# Altium project mix.PrjPCB
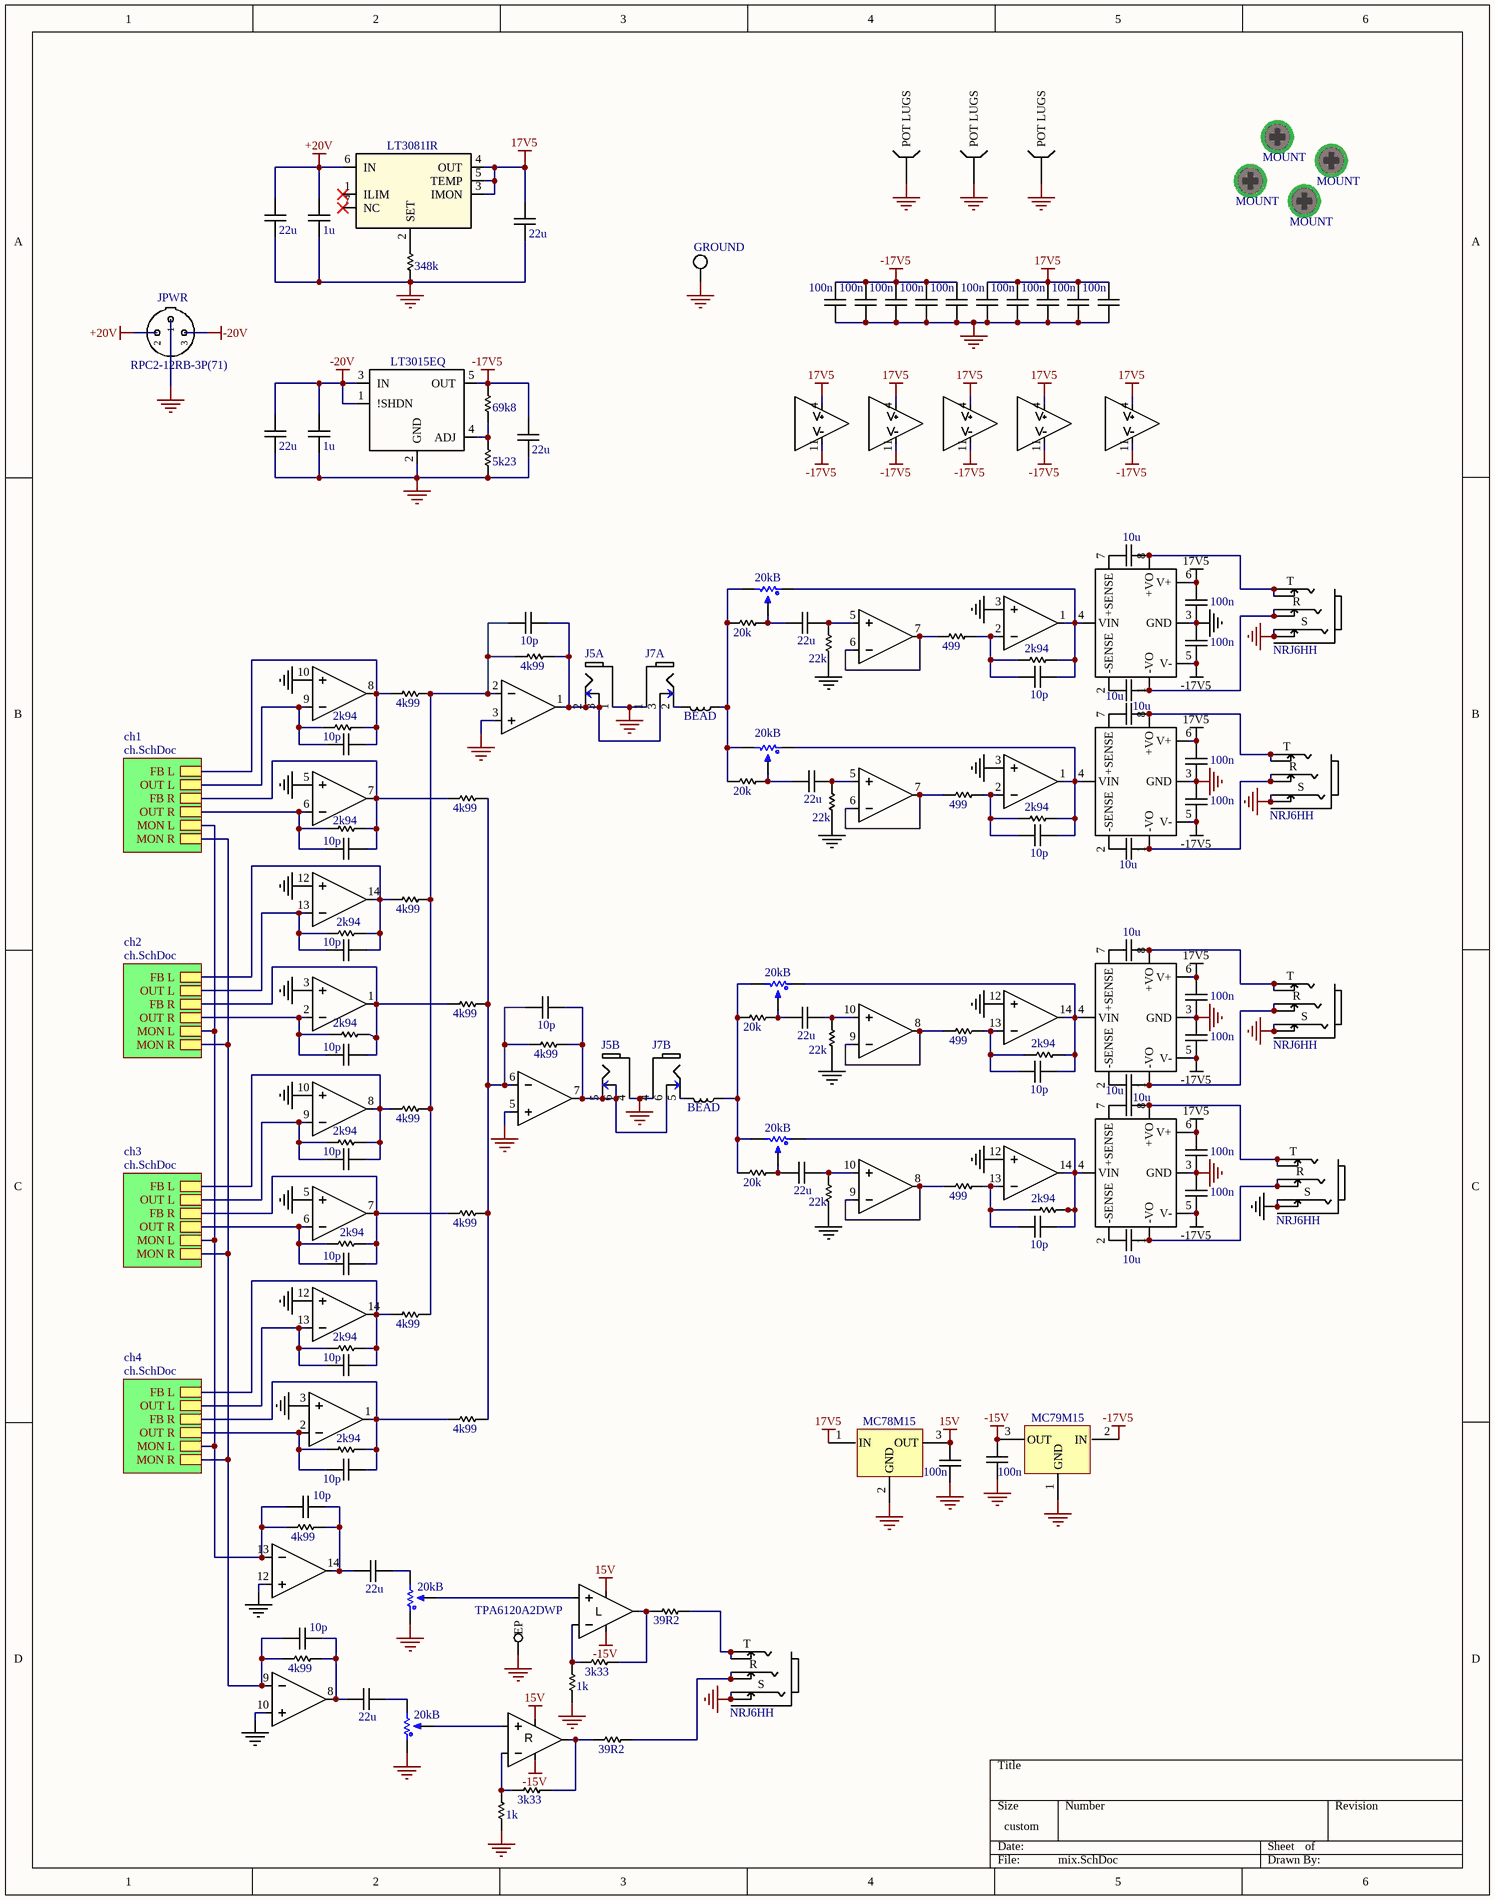
[diagram p0: mix.SchDoc]
3 sheets, 1145 parts. Net scope: hierarchical (ports join the sheet entries above them; power ports are global).
Board file: mix.pcbdoc
Sheets:
  mix.SchDoc
    ch1 = ch.SchDoc
      rxo = xover.SchDoc
      lxo = xover.SchDoc
    ch2 = ch.SchDoc
      rxo = xover.SchDoc
      lxo = xover.SchDoc
    ch3 = ch.SchDoc
      rxo = xover.SchDoc
      lxo = xover.SchDoc
    ch4 = ch.SchDoc
      rxo = xover.SchDoc
      lxo = xover.SchDoc

## Sheet mix.SchDoc
size 279 x 355 mm

### Parts
C5  100n  [0805]
C7  100n  [0805]
C15  100n  [0805]
C17  100n  [0805]
C23  10p  [0805]
C24  100n  [0805]
C26  100n  [0805]
C31  100n  [0805]
C33  100n  [0805]
C36  22u  [0805]
C37  10p  [0805]
C38  100n  [0805]
C39  22u  [0805]
C40  100n  [0805]
C41  10p  [0805]
C43  10p  [0805]
C45  10p  [0805]
C46  100n  [0805]
C47  10p  [0805]
C48  22u  [0805]
C49  100n  [0805]
C50  10p  [0805]
C52  22u  [0805]
C54  10p  [0805]
C55  22u  [0805]
C56  10p  [0805]
C57  22u  [0805]
C58  10p  [0805]
C59  10p  [0805]
C60  10p  [0805]
C61  10p  [0805]
C62  10p  [0805]
C63  10p  [0805]
C64  10p  [0805]
C983  22u  [0805]
C984  1u  [0805]
C985  22u  [0805]
C988  22u  [0805]
C989  1u  [0805]
C990  22u  [0805]
C1002  100n  [0805]
C1003  100n  [0805]
C1004  100n  [0805]
C1005  100n  [0805]
C1006  100n  [0805]
C1007  100n  [0805]
C1008  100n  [0805]
C1010  100n  [0805]
C2001  10u  [0805]
C2002  10u  [0805]
C2003  10u  [0805]
C2004  10u  [0805]
C2005  10u  [0805]
C2006  10u  [0805]
C2007  10u  [0805]
C2008  10u  [0805]
GROUND  PHONO  [PAD]  (value not drawn)  (no BOM)
J1  NRJ6HH  [NRJ6HH]
J2  NRJ6HH  [NRJ6HH]
J3  NRJ6HH  [NRJ6HH]
J4  NRJ6HH  [NRJ6HH]
J5  PJRAN2X1U01AUX  [PJRAN2X1U01AUX]  (value not drawn)  (parts A,B of 2)
J6  NRJ6HH  [NRJ6HH]
J7  PJRAN2X1U01AUX  [PJRAN2X1U01AUX]  (value not drawn)  (parts A,B of 2)
JPWR  RPC2-12RB-3P(71)  [RPC2-12RB-3P(71)]
L3  BEAD  [0805]
L4  BEAD  [0805]
MH1  MOUNT  [MOUNT]  (no BOM)
MH2  MOUNT  [MOUNT]  (no BOM)
MH3  MOUNT  [MOUNT]  (no BOM)
MH4  MOUNT  [MOUNT]  (no BOM)
R5  20kB  [P0925N-FC15AR10K]  (parts A,B,C of 3)
R6  20kB  [P0925N-FC15AR10K]  (parts A,B,C of 3)
R7  20kB  [P0925N-FC15AR10K]  (parts A,B,C of 3)
R13  4k99  [0805]
R26  3k33  [0805]
R27  3k33  [0805]
R29  1k  [0805]
R30  39R2  [0805]
R31  39R2  [0805]
R32  1k  [0805]
R47  499  [0805]
R49  22k  [0805]
R50  2k94  [0805]
R51  4k99  [0805]
R71  20k  [0805]
R75  20k  [0805]
R76  499  [0805]
R77  2k94  [0805]
R78  22k  [0805]
R79  2k94  [0805]
R80  4k99  [0805]
R81  2k94  [0805]
R82  4k99  [0805]
R83  2k94  [0805]
R84  499  [0805]
R85  4k99  [0805]
R86  22k  [0805]
R87  2k94  [0805]
R88  4k99  [0805]
R89  2k94  [0805]
R90  499  [0805]
R91  22k  [0805]
R92  4k99  [0805]
R93  2k94  [0805]
R94  2k94  [0805]
R95  4k99  [0805]
R96  2k94  [0805]
R97  4k99  [0805]
R98  2k94  [0805]
R99  4k99  [0805]
R100  2k94  [0805]
R101  348k  [0805]
R102  5k23  [0805]
R103  69k8  [0805]
R104  20k  [0805]
R105  20k  [0805]
R106  4k99  [0805]
R107  4k99  [0805]
U6  OPA16X4  [SOIC127P600X175-14M]  (value not drawn)  (parts A,B,C,D,E of 5)
U7  OPA16X4  [SOIC127P600X175-14M]  (value not drawn)  (parts A,B,C,D,E of 5)
U8  OPA16X4  [SOIC127P600X175-14M]  (value not drawn)  (parts A,B,C,D,E of 5)
U9  OPA16X4  [SOIC127P600X175-14M]  (value not drawn)  (parts A,B,C,D,E of 5)
U10  OPA16X4  [SOIC127P600X175-14M]  (value not drawn)  (parts A,B,C,D,E of 5)
U11  LT3081IR  [DDPAK-7]
U12  LT3015EQ  [DDPAK-5_Q]
U13  DRV135  [SOIC127P600X175-8M]  (value not drawn)
U14  DRV135  [SOIC127P600X175-8M]  (value not drawn)
U15  DRV135  [SOIC127P600X175-8M]  (value not drawn)
U16  DRV135  [SOIC127P600X175-8M]  (value not drawn)
U17  TPA6120A2DWP  [SOIC127P1040X265_HS-21M]  (parts A,B,C of 3)
U18  MC78M15  [DPAK-3]
U19  MC79M15  [DPAK-3]

### Sub-sheets
ch1 = ch.SchDoc: OUT L, OUT R, MON L, MON R, FB L, FB R
ch2 = ch.SchDoc: OUT L, OUT R, MON L, MON R, FB L, FB R
ch3 = ch.SchDoc: OUT L, OUT R, MON L, MON R, FB L, FB R
ch4 = ch.SchDoc: OUT L, OUT R, MON L, MON R, FB L, FB R

### Nets
15V: C1002.1 U17.3(LV+) U17.18(RV+) U18.3(OUT)
17V5: C15.1 C17.1 C24.1 C31.1 C38.1 C46.1 C985.2 C1005.1 C1007.1 C1010.1 U6.4(V+) U7.4(V+) U8.4(V+) U9.4(V+) U10.4(V+) U11.3(IMON) U11.4(OUT) U11.5(TEMP) U13.6(V+) U14.6(V+) U15.6(V+) U16.6(V+) U18.1(IN)
+20V: C983.2 C984.2 JPWR.2 U11.6(IN)
-15V: C1003.1 U17.1(LV-) U17.20(RV-) U19.3(OUT)
-17V5: C5.1 C7.1 C26.2 C33.2 C40.2 C49.2 C990.2 C1004.1 C1006.1 C1008.1 R103.2 U6.11(V-) U7.11(V-) U8.11(V-) U9.11(V-) U10.11(V-) U12.5(OUT) U13.5(V-) U14.5(V-) U15.5(V-) U16.5(V-) U19.2(IN)
-20V: C988.2 C989.2 JPWR.3 U12.1(!SHDN) U12.3(IN)
GND: C5.2 C7.2 C15.2 C17.2 C24.2 C26.1 C31.2 C33.1 C38.2 C40.1 C46.2 C49.1 C983.1 C984.1 C985.1 C988.1 C989.1 C990.1 C1002.2 C1003.2 C1004.2 C1005.2 C1006.2 C1007.2 C1008.2 C1010.2 GROUND.1 J1.S J1.SN J2.S J2.SN J3.S J3.SN J4.S J4.SN J5.1 J5.4 J6.S J6.SN J7.1 J7.4 JPWR.1 R5.7(POT_LUGS) R6.7(POT_LUGS) R7.1 R7.4 R7.7(POT_LUGS) R29.1 R32.1 R49.1 R78.1 R86.1 R91.1 R101.1 R102.1 U6.3(+IN_A) U6.5(IN_B+) U6.10(IN_C+) U6.12(IN_D+) U7.3(+IN_A) U7.5(IN_B+) U7.10(IN_C+) U7.12(IN_D+) U8.3(+IN_A) U8.12(IN_D+) U9.3(+IN_A) U9.12(IN_D+) U10.3(+IN_A) U10.5(IN_B+) U10.10(IN_C+) U10.12(IN_D+) U12.2(GND) U13.3(GND) U14.3(GND) U15.3(GND) U16.3(GND) U17.21(EP) U18.2(GND) U19.1(GND)
NetC23_1: C23.1 R13.1 R51.2 R82.2 R92.2 R97.2 U10.2(-IN_A)
NetC23_2: C23.2 J5.2 J5.3 J7.3 R13.2 U10.1(OUT_A)
NetC36_1: C36.1 R5.2 R71.1
NetC36_2: C36.2 R49.2 U9.5(IN_B+)
NetC37_1: C37.1 R47.2 R50.1 U9.2(-IN_A)
NetC37_2: C37.2 R5.1 R50.2 U9.1(OUT_A) U13.4(VIN)
NetC39_1: C39.1 R6.2 R75.1
NetC39_2: C39.2 R78.2 U8.5(IN_B+)
NetC41_1: C41.1 R77.1 U6.9(IN_C-) ; sheet ch1/OUT L
NetC41_2: C41.2 R51.1 R77.2 U6.8(OUT_C) ; sheet ch1/FB L
NetC43_1: C43.1 R76.2 R79.1 U8.2(-IN_A)
NetC43_2: C43.2 R6.1 R79.2 U8.1(OUT_A) U14.4(VIN)
NetC45_1: C45.1 R81.1 U6.6(IN_B-) ; sheet ch1/OUT R
NetC45_2: C45.2 R80.1 R81.2 U6.7(OUT_B) ; sheet ch1/FB R
NetC47_1: C47.1 R80.2 R85.1 R88.2 R95.2 R99.2 U10.6(IN_B-)
NetC47_2: C47.2 J5.5 J5.6 J7.6 R85.2 U10.7(OUT_B)
NetC48_1: C48.1 R5.5 R104.1
NetC48_2: C48.2 R86.2 U9.10(IN_C+)
NetC50_1: C50.1 R83.1 U6.13(IN_D-) ; sheet ch2/OUT L
NetC50_2: C50.2 R82.1 R83.2 U6.14(OUT_D) ; sheet ch2/FB L
NetC52_1: C52.1 C63.2 R106.2 U10.14(OUT_D)
NetC52_2: C52.2 R7.3
NetC54_1: C54.1 R84.2 R87.1 U9.13(IN_D-)
NetC54_2: C54.2 R5.4 R87.2 U9.14(OUT_D) U15.4(VIN)
NetC55_1: C55.1 C64.2 R107.2 U10.8(OUT_C)
NetC55_2: C55.2 R7.6
NetC56_1: C56.1 R89.1 U6.2(-IN_A) ; sheet ch2/OUT R
NetC56_2: C56.2 R88.1 R89.2 U6.1(OUT_A) ; sheet ch2/FB R
NetC57_1: C57.1 R6.5 R105.1
NetC57_2: C57.2 R91.2 U8.10(IN_C+)
NetC58_1: C58.1 R90.2 R93.1 U8.13(IN_D-)
NetC58_2: C58.2 R6.4 R93.2 U8.14(OUT_D) U16.4(VIN)
NetC59_1: C59.1 R94.1 U7.9(IN_C-) ; sheet ch3/OUT L
NetC59_2: C59.2 R92.1 R94.2 U7.8(OUT_C) ; sheet ch3/FB L
NetC60_1: C60.1 R96.1 U7.6(IN_B-) ; sheet ch3/OUT R
NetC60_2: C60.2 R95.1 R96.2 U7.7(OUT_B) ; sheet ch3/FB R
NetC61_1: C61.1 R98.1 U7.13(IN_D-) ; sheet ch4/OUT L
NetC61_2: C61.2 R97.1 R98.2 U7.14(OUT_D) ; sheet ch4/FB L
NetC62_1: C62.1 R100.1 U7.2(-IN_A) ; sheet ch4/OUT R
NetC62_2: C62.2 R99.1 R100.2 U7.1(OUT_A) ; sheet ch4/FB R
NetC63_1: C63.1 R106.1 U10.13(IN_D-) ; sheet ch1/MON L, sheet ch2/MON L, sheet ch3/MON L, sheet ch4/MON L
NetC64_1: C64.1 R107.1 U10.9(IN_C-) ; sheet ch1/MON R, sheet ch2/MON R, sheet ch3/MON R, sheet ch4/MON R
NetC2001_1: C2001.1 U13.7(+SENSE)
NetC2001_2: C2001.2 J1.T J1.TN U13.8(+VO)
NetC2002_1: C2002.1 U13.2(-SENSE)
NetC2002_2: C2002.2 J1.R J1.RN U13.1(-VO)
NetC2003_1: C2003.1 U14.7(+SENSE)
NetC2003_2: C2003.2 J2.T J2.TN U14.8(+VO)
NetC2004_1: C2004.1 U14.2(-SENSE)
NetC2004_2: C2004.2 J2.R J2.RN U14.1(-VO)
NetC2005_1: C2005.1 U15.7(+SENSE)
NetC2005_2: C2005.2 J3.T J3.TN U15.8(+VO)
NetC2006_1: C2006.1 U15.2(-SENSE)
NetC2006_2: C2006.2 J3.R J3.RN U15.1(-VO)
NetC2007_1: C2007.1 U16.7(+SENSE)
NetC2007_2: C2007.2 J4.T J4.TN U16.8(+VO)
NetC2008_1: C2008.1 U16.2(-SENSE)
NetC2008_2: C2008.2 J4.R J4.RN U16.1(-VO)
NetJ6_R: J6.R J6.RN R31.2
NetJ6_T: J6.T J6.TN R30.2
NetJ7_2: J7.2 L3.2
NetJ7_5: J7.5 L4.2
NetL3_1: L3.1 R5.3 R6.3 R71.2 R75.2
NetL4_1: L4.1 R5.6 R6.6 R104.2 R105.2
NetR7_2: R7.2 U17.4(LIN+)
NetR7_5: R7.5 U17.17(RIN+)
NetR26_1: R26.1 R32.2 U17.16(RIN-)
NetR26_2: R26.2 R31.1 U17.19(ROUT)
NetR27_1: R27.1 R29.2 U17.5(LIN-)
NetR27_2: R27.2 R30.1 U17.2(LOUT)
NetR47_1: R47.1 U9.6(IN_B-) U9.7(OUT_B)
NetR76_1: R76.1 U8.6(IN_B-) U8.7(OUT_B)
NetR84_1: R84.1 U9.8(OUT_C) U9.9(IN_C-)
NetR90_1: R90.1 U8.8(OUT_C) U8.9(IN_C-)
NetR101_2: R101.2 U11.2(SET)
NetR102_2: R102.2 R103.1 U12.4(ADJ)

Not connected (* = marked no-connect by the designer): U11 1(ILIM)* 7(NC)*

### Notes on the sheet
- (in symbol TPA6120A2DWP, part A) L
- (in symbol TPA6120A2DWP, part B) R

### Library data of the parts
C5 C7 C15 C17 C24 C26 C31 C33 C38 C40 C46 C49 C1002-C1008 C1010 = CAP: PartNumber: C0805C104K1RAC7800; Supplier 1: Arrow; Supplier Part Number 1: C0805C104K1RAC7800
C23 C37 C41 C43 C45 C47 C50 C54 C56 C58-C64 = CAP: PartNumber: CC0805JRNPO9BN100; Supplier 1: Arrow; Supplier Part Number 1: CC0805JRNPO9BN100
C36 C39 C48 C52 C55 C57 C983 C985 C988 C990 = CAP: PartNumber: GRT21BR61E226ME13L; Supplier 1: Arrow; Supplier Part Number 1: GRT21BR61E226ME13L
  C983 C985 C988 C990: Value: 22u
C984 C989 = CAP: PartNumber: CL21B105KBFNNNF; Value: 1u; Supplier 1: Arrow; Supplier Part Number 1: CL21B105KBFNNNF
C2001-C2008 = CAP: PartNumber: NMC0805X5R106K25TRPLP2KF; Supplier 1: Arrow; Supplier Part Number 1: NMC0805X5R106K25TRPLP2KF
GROUND = PAD: Supplier 1: Arrow
J1-J4 J6 = NRJ6HH: PartNumber: NRJ6HH-AU; Supplier 1: Arrow; Supplier Part Number 1: NRJ6HH-AU
L3 L4 = BLM21PG121SH1D: Supplier 1: Arrow; Supplier Part Number 1: BLM21PG121SH1D; PartNumber: BLM21PG121SH1D
R5-R7 = P0925N-FC15BR20K: Supplier 1: Arrow; Supplier Part Number 1: P0925N-FC15BR20K; PartNumber: P0925N-FC15BR20K
R13 R51 R80 R82 R85 R88 R92 R95 R97 R99 R106 R107 = RES: PartNumber: ERJ-6ENF4991V; Supplier 1: Arrow; Supplier Part Number 1: ERJ-6ENF4991V
R26 R27 = RES: PartNumber: ERJ-6ENF1002V; Supplier 1: Arrow; Supplier Part Number 1: ERJ-6ENF1002V
R29 R32 = RES: PartNumber: ERJ-6ENF1001V; Supplier 1: Arrow; Supplier Part Number 1: ERJ-6ENF1001V
R30 R31 = RES: PartNumber: ERJ-6ENF39R2V; Supplier 1: Arrow; Supplier Part Number 1: ERJ-6ENF39R2V
R47 R76 R84 R90 = RES: PartNumber: ERJ-6ENF4990V; Supplier 1: Arrow; Supplier Part Number 1: ERJ-6ENF4990V
R49 R78 R86 R91 = RES: PartNumber: ERJ-6ENF2202V; Supplier 1: Arrow; Supplier Part Number 1: ERJ-6ENF2202V
R50 R77 R79 R81 R83 R87 R89 R93 R94 R96 R98 R100 = RES: PartNumber: ERJ-6ENF2941V; Supplier 1: Arrow; Supplier Part Number 1: ERJ-6ENF2941V
R71 R75 R104 R105 = RES: PartNumber: ERJ-6ENF2002V; Supplier 1: Arrow; Supplier Part Number 1: ERJ-6ENF2002V
R101 = RES: PartNumber: ERJ-PB6B3483V; Supplier 1: Arrow; Supplier Part Number 1: ERJ-PB6B3483V
R102 = RES: PartNumber: ERJ-PB6B5231V; Supplier 1: Arrow; Supplier Part Number 1: ERJ-PB6B5231V
R103 = RES: PartNumber: ERJ-PB6B6982V; Supplier 1: Arrow; Supplier Part Number 1: ERJ-PB6B6982V
U6-U10 = OPA16X4: PartNumber: OPA1664AIDR; Supplier 1: Arrow; Supplier Part Number 1: OPA1664AIDR
U11 = LT3081IR: Imported; PartNumber: LT3081IR#PBF; Supplier 1: Arrow; Supplier Part Number 1: LT3081IR#PBF
U12 = LT3015EQ: PartNumber: LT3015EQ#PBF; Supplier 1: Arrow; Supplier Part Number 1: LT3015EQ#PBF
U13-U16 = DRV135UA: PartNumber: DRV135UAG4; Supplier 1: Arrow; Supplier Part Number 1: DRV135UAG4
U17 = TPA6120A2DWP: PartNumber: TPA6120A2DWPR; Supplier 1: Arrow; Supplier Part Number 1: TPA6120A2DWPR
U18 = MC78M15CDTRKG: Supplier 1: Arrow; Supplier Part Number 1: MC78M15CDTRKG; PartNumber: MC78M15CDTRKG
U19 = MC79M15CDTRKG: Supplier 1: Arrow; Supplier Part Number 1: MC79M15CDTRKG; PartNumber: MC79M15CDTRKG
J5 J7 = PJRAN2X1U01AUX: Supplier 1: Arrow; Supplier Part Number 1: PJRAN2X1U01AUX; PartNumber: PJRAN2X1U01AUX
JPWR = RPC2-12RB-3P(71): Supplier 1: Arrow
MH1-MH4 = MOUNT: Supplier 1: Arrow

## Sheet ch.SchDoc
size 406 x 241 mm
Used 4 times, as channels ch1, ch2, ch3, ch4. Parts and nets are listed once, with the designators drawn on the sheet.
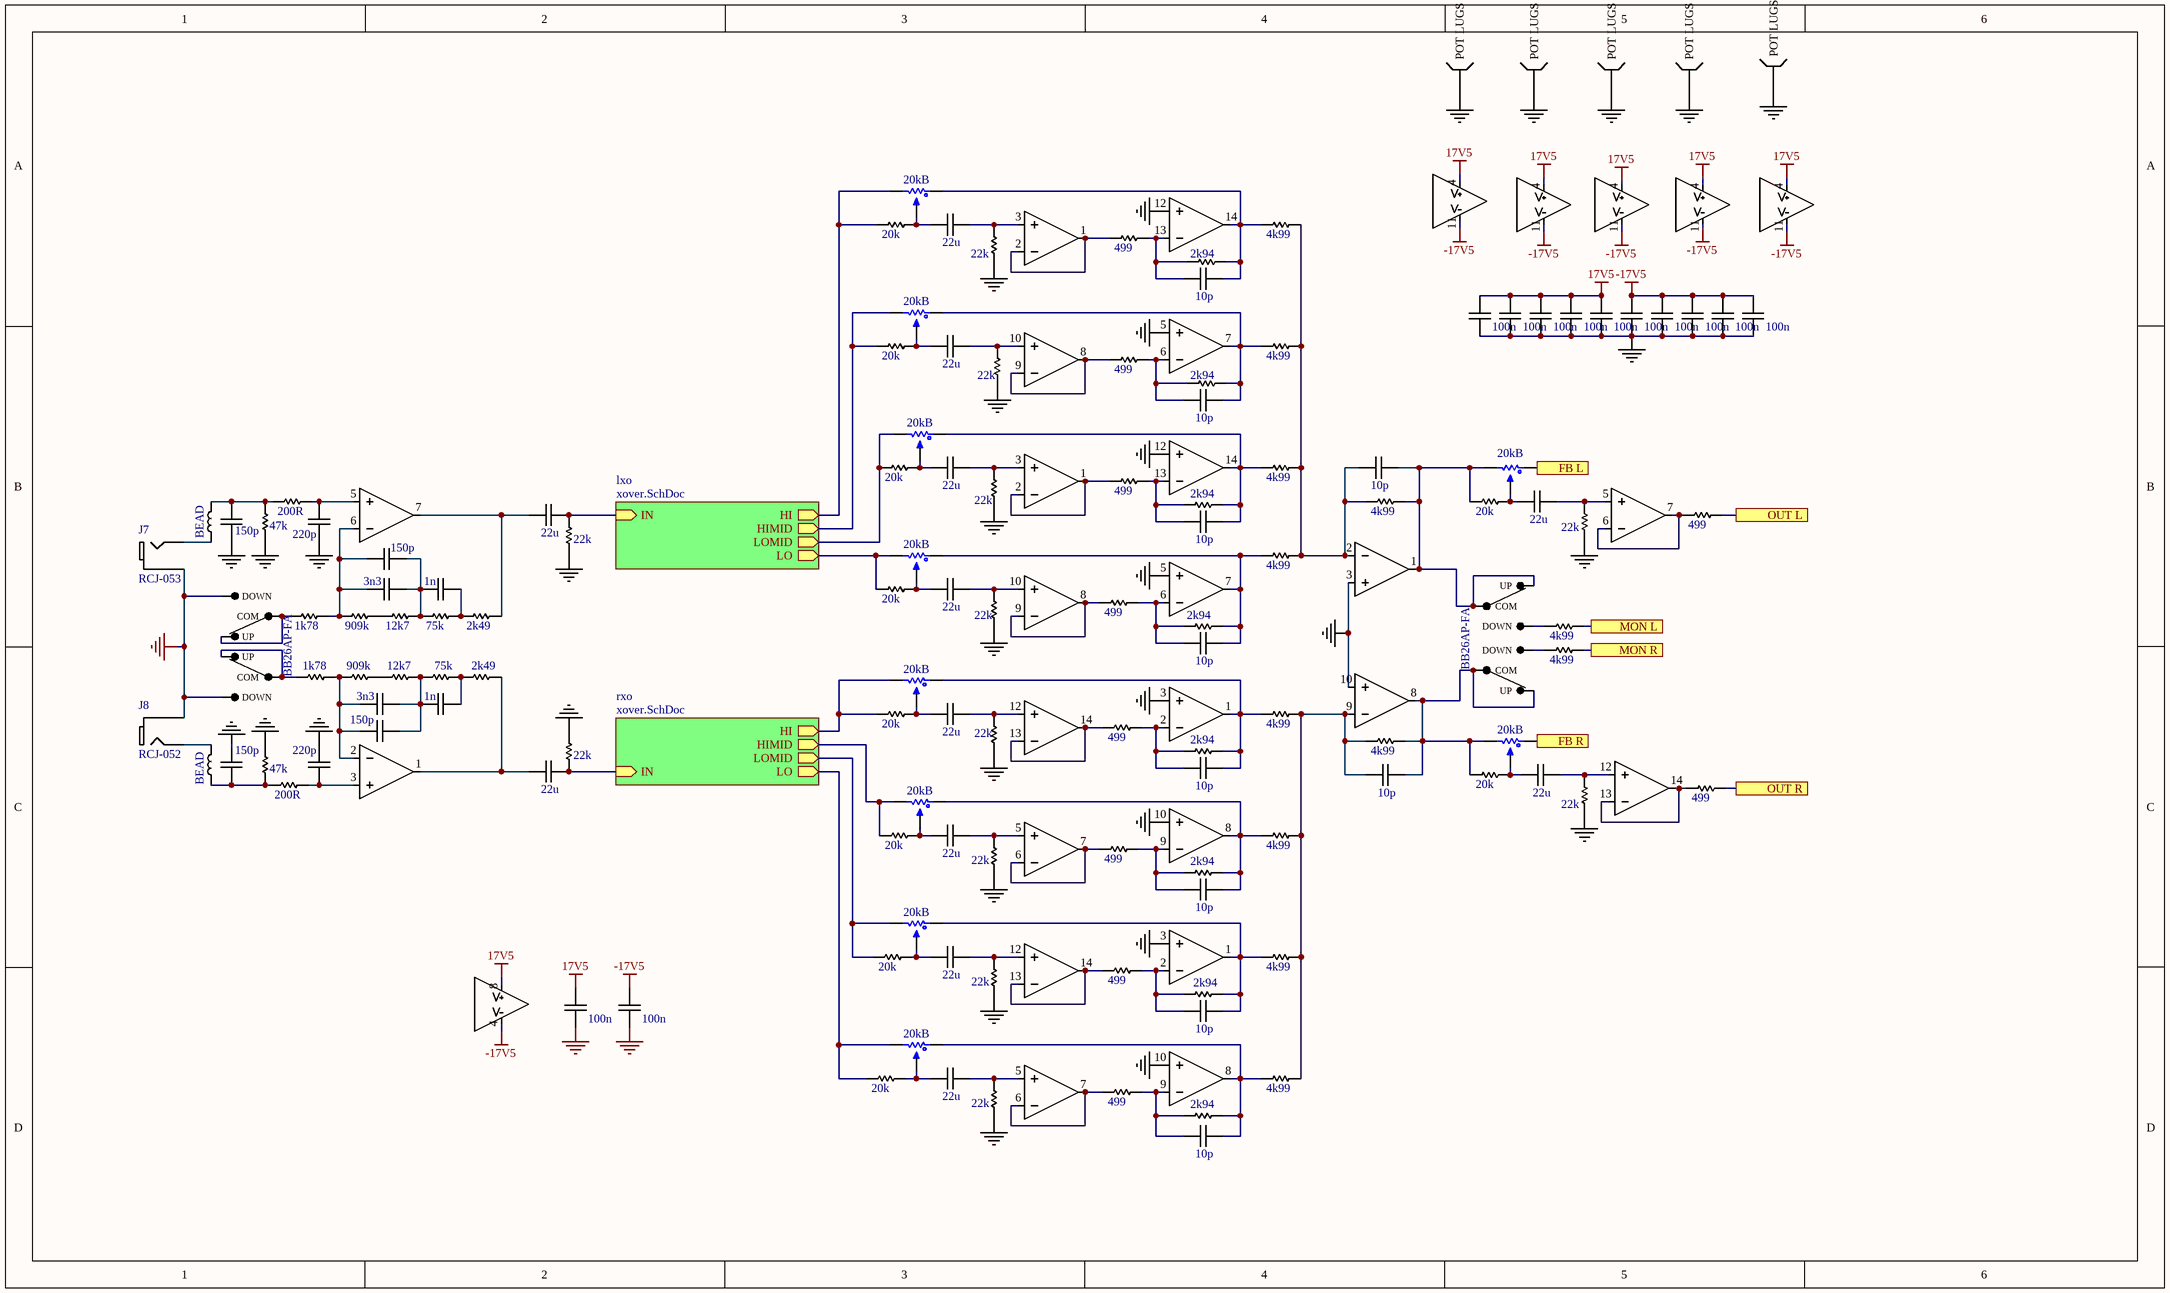
[diagram p1: ch.SchDoc]

### Parts
C1  22u  [0805]
C2  10p  [0805]
C3  100n  [0805]
C4  100n  [0805]
C6  100n  [0805]
C8  100n  [0805]
C9  100n  [0805]
C10  22u  [0805]
C11  10p  [0805]
C12  100n  [0805]
C13  22u  [0805]
C14  22u  [0805]
C16  10p  [0805]
C18  22u  [0805]
C19  10p  [0805]
C20  22u  [0805]
C21  10p  [0805]
C22  22u  [0805]
C25  22u  [0805]
C27  10p  [0805]
C28  10p  [0805]
C29  22u  [0805]
C32  10p  [0805]
C34  22u  [0805]
C35  10p  [0805]
C42  10p  [0805]
C63  220p  [0805]
C64  150p  [0805]
C65  22u  [0805]
C67  150p  [0805]
C68  3n3  [0805]
C69  1n  [0805]
C71  100n  [0805]
C72  100n  [0805]
C74  3n3  [0805]
C75  1n  [0805]
C76  150p  [0805]
C78  150p  [0805]
C79  22u  [0805]
C80  220p  [0805]
C203  100n  [0805]
C208  100n  [0805]
C210  100n  [0805]
C215  100n  [0805]
J7  RCJ-053  [RCJ-053]
J8  RCJ-052  [RCJ-052]
L1  BEAD  [0805]
L2  BEAD  [0805]
R1  20kB  [P0925N-FC15AR10K]  (parts A,B,C of 3)
R2  499  [0805]
R3  22k  [0805]
R4  2k94  [0805]
R8  499  [0805]
R9  22k  [0805]
R10  2k94  [0805]
R11  499  [0805]
R12  22k  [0805]
R14  4k99  [0805]
R15  499  [0805]
R16  20k  [0805]
R17  2k94  [0805]
R18  20k  [0805]
R19  22k  [0805]
R20  4k99  [0805]
R21  4k99  [0805]
R22  499  [0805]
R23  22k  [0805]
R24  2k94  [0805]
R25  20k  [0805]
R28  499  [0805]
R33  22k  [0805]
R34  2k94  [0805]
R35  20k  [0805]
R36  499  [0805]
R37  22k  [0805]
R38  499  [0805]
R39  22k  [0805]
R40  2k94  [0805]
R41  499  [0805]
R42  22k  [0805]
R43  2k94  [0805]
R44  499  [0805]
R45  22k  [0805]
R46  2k94  [0805]
R52  20k  [0805]
R53  200R  [0805]
R54  22k  [0805]
R55  47k  [0805]
R56  20k  [0805]
R57  909k  [0805]
R58  12k7  [0805]
R59  2k49  [0805]
R60  20k  [0805]
R61  20k  [0805]
R62  1k78  [0805]
R63  75k  [0805]
R64  20k  [0805]
R65  20k  [0805]
R66  909k  [0805]
R67  12k7  [0805]
R68  1k78  [0805]
R69  75k  [0805]
R70  2k49  [0805]
R72  47k  [0805]
R73  22k  [0805]
R74  200R  [0805]
R75  4k99  [0805]
R76  4k99  [0805]
R148  20kB  [P0925N-FC15AR10K]  (parts A,B,C of 3)
R149  20kB  [P0925N-FC15AR10K]  (parts A,B,C of 3)
R150  20kB  [P0925N-FC15AR10K]  (parts A,B,C of 3)
R151  20kB  [P0925N-FC15AR10K]  (parts A,B,C of 3)
R173  4k99  [0805]
R177  4k99  [0805]
R184  4k99  [0805]
R187  4k99  [0805]
R200  4k99  [0805]
R201  4k99  [0805]
R207  4k99  [0805]
SW1  BB26AP-FA  [BB26AP-FA]  (parts A,B of 2)
SW5  BB26AP-FA  [BB26AP-FA]  (value not drawn)  (parts A,B of 2)
U1  OPA16X4  [SOIC127P600X175-14M]  (value not drawn)  (parts A,B,C,D,E of 5)
U2  OPA16X4  [SOIC127P600X175-14M]  (value not drawn)  (parts A,B,C,D,E of 5)
U3  OPA16X4  [SOIC127P600X175-14M]  (value not drawn)  (parts A,B,C,D,E of 5)
U4  OPA16X4  [SOIC127P600X175-14M]  (value not drawn)  (parts A,B,C,D,E of 5)
U5  OPA16X4  [SOIC127P600X175-14M]  (value not drawn)  (parts A,B,C,D,E of 5)
U20  OPA16X2  [SOIC127P600X175-8M]  (value not drawn)  (parts A,B,C of 3)

### Sub-sheets
lxo = xover.SchDoc: IN (in), HI (out), HIMID (out), LOMID (out), LO (out)
rxo = xover.SchDoc: IN (in), HI (out), HIMID (out), LOMID (out), LO (out)

### Ports
FB L, FB R, MON L, MON R, OUT L, OUT R

### Nets
17V5: C3.1 C4.1 C9.1 C71.1 C203.1 C208.1 U1.4(V+) U2.4(V+) U3.4(V+) U4.4(V+) U5.4(V+) U20.8(V+)
-17V5: C6.1 C8.1 C12.1 C72.1 C210.1 C215.1 U1.11(V-) U2.11(V-) U3.11(V-) U4.11(V-) U5.11(V-) U20.4(V-)
GND: C3.2 C4.2 C6.2 C8.2 C9.2 C12.2 C63.1 C64.1 C71.2 C72.2 C78.2 C80.2 C203.2 C208.2 C210.2 C215.2 J7.1 J8.1 R1.7(POT_LUGS) R3.1 R9.1 R12.1 R19.1 R23.1 R33.1 R37.1 R39.1 R42.1 R45.1 R54.2 R55.1 R72.2 R73.1 R148.7(POT_LUGS) R149.7(POT_LUGS) R150.7(POT_LUGS) R151.7(POT_LUGS) SW5.1(DOWN) SW5.4(DOWN) U1.5(IN_B+) U1.12(IN_D+) U2.5(IN_B+) U2.12(IN_D+) U3.3(+IN_A) U3.10(IN_C+) U4.3(+IN_A) U4.10(IN_C+) U5.3(+IN_A) U5.10(IN_C+)
FB L: R1.1 ; port FB L
FB R: R1.4 ; port FB R
MON L: R75.2 ; port MON L
MON R: R76.2 ; port MON R
OUT L: R15.2 ; port OUT L
OUT R: R36.2 ; port OUT R
NetC1_1: C1.1 R16.1 R148.2
NetC1_2: C1.2 R3.2 U1.3(+IN_A)
NetC2_1: C2.1 R2.2 R4.1 U1.13(IN_D-)
NetC2_2: C2.2 R4.2 R148.1 R173.1 U1.14(OUT_D)
NetC10_1: C10.1 R18.1 R149.2
NetC10_2: C10.2 R9.2 U1.10(IN_C+)
NetC11_1: C11.1 R8.2 R10.1 U1.6(IN_B-)
NetC11_2: C11.2 R10.2 R149.1 R184.1 U1.7(OUT_B)
NetC13_1: C13.1 R25.1 R150.2
NetC13_2: C13.2 R12.2 U2.3(+IN_A)
NetC14_1: C14.1 R1.2 R35.1
NetC14_2: C14.2 R19.2 U5.5(IN_B+)
NetC16_1: C16.1 R11.2 R17.1 U2.13(IN_D-)
NetC16_2: C16.2 R17.2 R150.1 R200.1 U2.14(OUT_D)
NetC18_1: C18.1 R52.1 R151.2
NetC18_2: C18.2 R23.2 U2.10(IN_C+)
NetC19_1: C19.1 R22.2 R24.1 U2.6(IN_B-)
NetC19_2: C19.2 R20.1 R24.2 R151.1 U2.7(OUT_B)
NetC20_1: C20.1 R56.1 R148.5
NetC20_2: C20.2 R33.2 U3.12(IN_D+)
NetC21_1: C21.1 R28.2 R34.1 U3.2(-IN_A)
NetC21_2: C21.2 R34.2 R148.4 R177.1 U3.1(OUT_A)
NetC22_1: C22.1 R1.5 R60.1
NetC22_2: C22.2 R37.2 U5.12(IN_D+)
NetC25_1: C25.1 R61.1 R149.5
NetC25_2: C25.2 R39.2 U3.5(IN_B+)
NetC27_1: C27.1 R38.2 R40.1 U3.9(IN_C-)
NetC27_2: C27.2 R40.2 R149.4 R187.1 U3.8(OUT_C)
NetC28_1: C28.1 R14.1 R20.2 R173.2 R184.2 R200.2 U5.2(-IN_A)
NetC28_2: C28.2 R1.3 R14.2 R35.2 SW1.2(COM) SW1.3(UP) U5.1(OUT_A)
NetC29_1: C29.1 R64.1 R150.5
NetC29_2: C29.2 R42.2 U4.12(IN_D+)
NetC32_1: C32.1 R41.2 R43.1 U4.2(-IN_A)
NetC32_2: C32.2 R43.2 R150.4 R201.1 U4.1(OUT_A)
NetC34_1: C34.1 R65.1 R151.5
NetC34_2: C34.2 R45.2 U4.5(IN_B+)
NetC35_1: C35.1 R44.2 R46.1 U4.9(IN_C-)
NetC35_2: C35.2 R46.2 R151.4 R207.1 U4.8(OUT_C)
NetC42_1: C42.1 R21.1 R177.2 R187.2 R201.2 R207.2 U5.9(IN_C-)
NetC42_2: C42.2 R1.6 R21.2 R60.2 SW1.5(COM) SW1.6(UP) U5.8(OUT_C)
NetC63_2: C63.2 R53.2 U20.5(IN_B+)
NetC64_2: C64.2 L1.2 R53.1 R55.2
NetC65_1: C65.1 R59.1 U20.7(OUT_B)
NetC65_2: C65.2 R54.1 ; sheet lxo/IN
NetC67_1: C67.1 C68.1 C69.2 R58.2 R63.2
NetC67_2: C67.2 C68.2 R57.1 R62.2 U20.6(IN_B-)
NetC69_1: C69.1 R59.2 R63.1
NetC74_1: C74.1 C76.2 R66.1 R68.1 U20.2(-IN_A)
NetC74_2: C74.2 C75.1 C76.1 R67.2 R69.1
NetC75_2: C75.2 R69.2 R70.1
NetC78_1: C78.1 L2.1 R72.1 R74.1
NetC79_1: C79.1 R70.2 U20.1(OUT_A)
NetC79_2: C79.2 R73.2 ; sheet rxo/IN
NetC80_1: C80.1 R74.2 U20.3(+IN_A)
NetJ7_2: J7.2 L1.1
NetJ8_2: J8.2 L2.2
NetR2_1: R2.1 U1.1(OUT_A) U1.2(-IN_A)
NetR8_1: R8.1 U1.8(OUT_C) U1.9(IN_C-)
NetR11_1: R11.1 U2.1(OUT_A) U2.2(-IN_A)
NetR15_1: R15.1 U5.6(IN_B-) U5.7(OUT_B)
NetR16_2: R16.2 R148.3 ; sheet lxo/HI
NetR18_2: R18.2 R149.3 ; sheet lxo/HIMID
NetR22_1: R22.1 U2.8(OUT_C) U2.9(IN_C-)
NetR25_2: R25.2 R150.3 ; sheet lxo/LOMID
NetR28_1: R28.1 U3.13(IN_D-) U3.14(OUT_D)
NetR36_1: R36.1 U5.13(IN_D-) U5.14(OUT_D)
NetR38_1: R38.1 U3.6(IN_B-) U3.7(OUT_B)
NetR41_1: R41.1 U4.13(IN_D-) U4.14(OUT_D)
NetR44_1: R44.1 U4.6(IN_B-) U4.7(OUT_B)
NetR52_2: R52.2 R151.3 ; sheet lxo/LO
NetR56_2: R56.2 R148.6 ; sheet rxo/HI
NetR57_2: R57.2 R58.1
NetR61_2: R61.2 R149.6 ; sheet rxo/HIMID
NetR62_1: R62.1 SW5.2(COM) SW5.3(UP)
NetR64_2: R64.2 R150.6 ; sheet rxo/LOMID
NetR65_2: R65.2 R151.6 ; sheet rxo/LO
NetR66_2: R66.2 R67.1
NetR68_2: R68.2 SW5.5(COM) SW5.6(UP)
NetR75_1: R75.1 SW1.1(DOWN)
NetR76_1: R76.1 SW1.4(DOWN)

### Channels
ch1: designators end in _$ChannelName#1; ports FB L=NetC41_2 FB R=NetC45_2 MON L=NetC63_1 MON R=NetC64_1 OUT L=NetC41_1 OUT R=NetC45_1
ch2: designators end in _$ChannelName#2; ports FB L=NetC50_2 FB R=NetC56_2 MON L=NetC63_1 MON R=NetC64_1 OUT L=NetC50_1 OUT R=NetC56_1
ch3: designators end in _$ChannelName#3; ports FB L=NetC59_2 FB R=NetC60_2 MON L=NetC63_1 MON R=NetC64_1 OUT L=NetC59_1 OUT R=NetC60_1
ch4: designators end in _$ChannelName#4; ports FB L=NetC61_2 FB R=NetC62_2 MON L=NetC63_1 MON R=NetC64_1 OUT L=NetC61_1 OUT R=NetC62_1

### Library data of the parts
C1 C10 C13 C14 C18 C20 C22 C25 C29 C34 C65 C79 = CAP: PartNumber: GRT21BR61E226ME13L; Supplier 1: Arrow; Supplier Part Number 1: GRT21BR61E226ME13L
C2 C11 C16 C19 C21 C27 C28 C32 C35 C42 = CAP: PartNumber: CC0805JRNPO9BN100; Supplier 1: Arrow; Supplier Part Number 1: CC0805JRNPO9BN100
C3 C4 C6 C8 C9 C12 C71 C72 C203 C208 C210 C215 = CAP: PartNumber: C0805C104K1RAC7800; Supplier 1: Arrow; Supplier Part Number 1: C0805C104K1RAC7800
C63 C80 = CAP: PartNumber: C0805C221J1GACTU; Supplier 1: Arrow; Supplier Part Number 1: C0805C221J1GACTU
C64 C67 C76 C78 = CAP: PartNumber: 08055A151FAT2A; Supplier 1: Arrow; Supplier Part Number 1: 08055A151FAT2A
C68 C74 = CAP: PartNumber: GRM2165C1H332FA01D; Supplier 1: Arrow; Supplier Part Number 1: GRM2165C1H332FA01D
C69 C75 = CAP: PartNumber: GRM2165C1H102FA01J; Supplier 1: Arrow; Supplier Part Number 1: GRM2165C1H102FA01J
L1 L2 = BLM21PG121SH1D: Supplier 1: Arrow; Supplier Part Number 1: BLM21PG121SH1D; PartNumber: BLM21PG121SH1D
R1 R148-R151 = P0925N-FC15BR20K: Supplier 1: Arrow; Supplier Part Number 1: P0925N-FC15BR20K; PartNumber: P0925N-FC15BR20K
R2 R8 R11 R15 R22 R28 R36 R38 R41 R44 = RES: PartNumber: ERJ-6ENF4990V; Supplier 1: Arrow; Supplier Part Number 1: ERJ-6ENF4990V
R3 R9 R12 R19 R23 R33 R37 R39 R42 R45 R54 R73 = RES: PartNumber: ERJ-6ENF2202V; Supplier 1: Arrow; Supplier Part Number 1: ERJ-6ENF2202V
R4 R10 R17 R24 R34 R40 R43 R46 = RES: PartNumber: ERJ-6ENF2941V; Supplier 1: Arrow; Supplier Part Number 1: ERJ-6ENF2941V
R14 R20 R21 R75 R76 R173 R177 R184 R187 R200 R201 R207 = RES: PartNumber: ERJ-6ENF4991V; Supplier 1: Arrow; Supplier Part Number 1: ERJ-6ENF4991V
R16 R18 R25 R35 R52 R56 R60 R61 R64 R65 = RES: PartNumber: ERJ-6ENF2002V; Supplier 1: Arrow; Supplier Part Number 1: ERJ-6ENF2002V
R53 R74 = RES: PartNumber: ERJ-6ENF2000V; Supplier 1: Arrow; Supplier Part Number 1: ERJ-6ENF2000V
R55 R72 = RES: PartNumber: ERJ-6ENF4702V; Supplier 1: Arrow; Supplier Part Number 1: ERJ-6ENF4702V
R57 R66 = RES: PartNumber: ERJ-PB6B9093V; Supplier 1: Arrow; Supplier Part Number 1: ERJ-PB6B9093V
R58 R67 = RES: PartNumber: ERJ-PB6B1272V; Supplier 1: Arrow; Supplier Part Number 1: ERJ-PB6B1272V
R59 R70 = RES: PartNumber: ERA6AEB2491V; Supplier 1: Arrow; Supplier Part Number 1: ERA6AEB2491V
R62 R68 = RES: PartNumber: ERJ-PB6B1781V; Supplier 1: Arrow; Supplier Part Number 1: ERJ-PB6B1781V
R63 R69 = RES: PartNumber: ERA6AEB753V; Supplier 1: Arrow; Supplier Part Number 1: ERA6AEB753V
U1-U5 = OPA16X4: PartNumber: OPA1664AIDR; Supplier 1: Arrow; Supplier Part Number 1: OPA1664AIDR
U20 = OPA16X2: PartNumber: OPA1662AIDRQ1; Supplier 1: Arrow; Supplier Part Number 1: OPA1662AIDRQ1
J7 = RCJ-053: Supplier 1: Arrow; Supplier Part Number 1: RCJ-053; PartNumber: RCJ-053
J8 = RCJ-052: Supplier 1: Arrow; Supplier Part Number 1: RCJ-052; PartNumber: RCJ-052

## Sheet xover.SchDoc
size A
Used 8 times, as channels ch1/rxo, ch1/lxo, ch2/rxo, ch2/lxo, ch3/rxo, ch3/lxo, ch4/rxo, ch4/lxo. Parts and nets are listed once, with the designators drawn on the sheet.
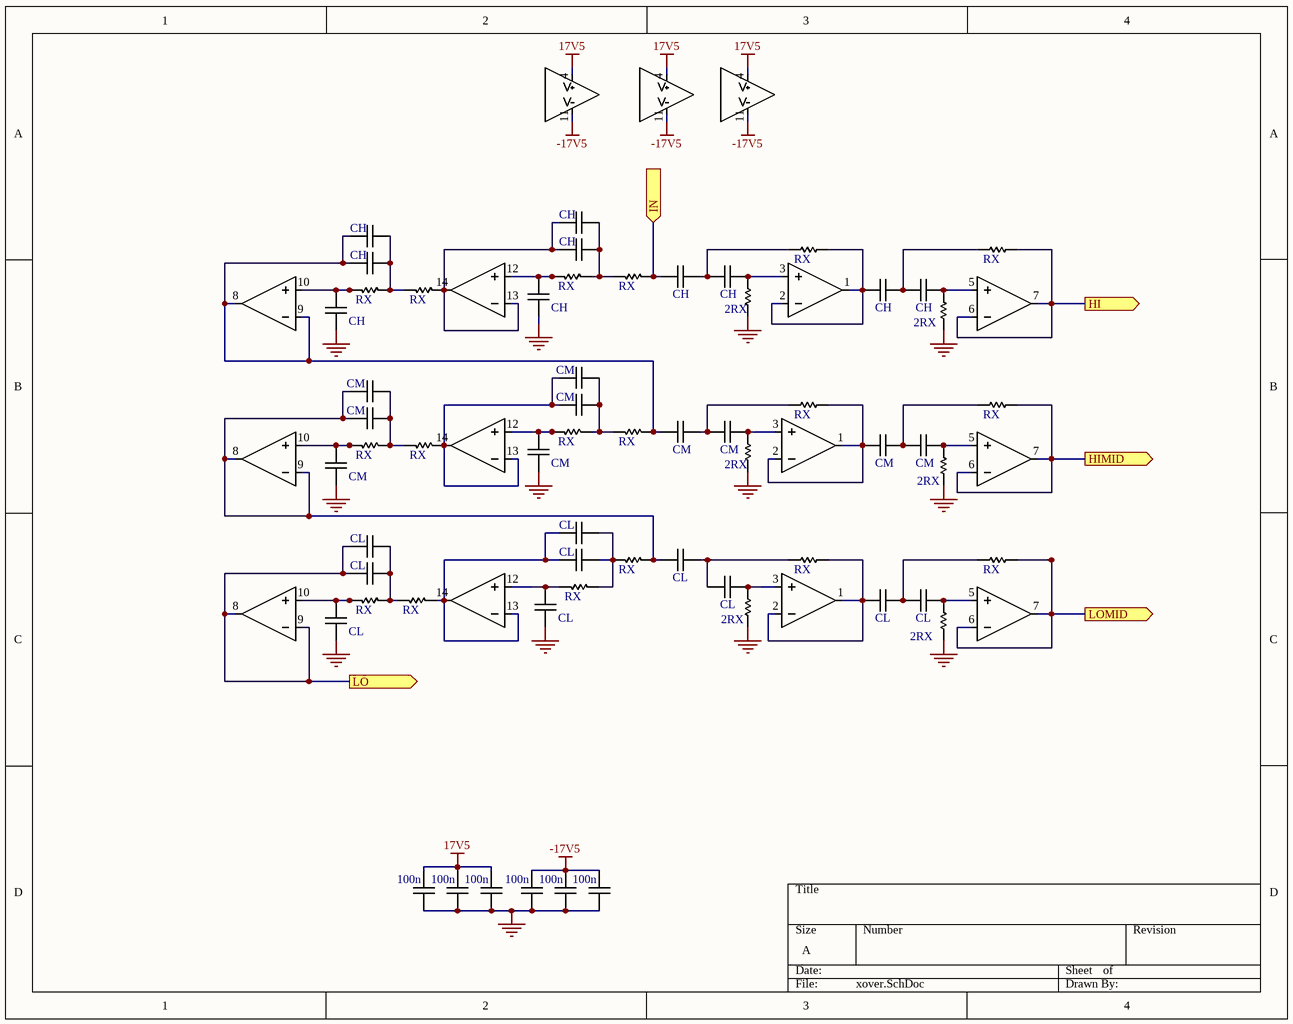
[diagram p2: xover.SchDoc]

### Parts
C136  CH  [0805]
C139  CH  [0805]
C142  CH  [0805]
C143  CH  [0805]
C145  CH  [0805]
C148  CH  [0805]
C149  CH  [0805]
C150  CH  [0805]
C152  CH  [0805]
C154  CH  [0805]
C155  CM  [0805]
C158  CM  [0805]
C162  CM  [0805]
C163  CM  [0805]
C166  CM  [0805]
C170  CM  [0805]
C171  CM  [0805]
C172  CM  [0805]
C174  CM  [0805]
C176  CM  [0805]
C180  CL  [0805]
C182  CL  [0805]
C185  CL  [0805]
C186  CL  [0805]
C188  CL  [0805]
C192  CL  [0805]
C193  CL  [0805]
C194  CL  [0805]
C198  CL  [0805]
C200  CL  [0805]
C204  100n  [0805]
C206  100n  [0805]
C211  100n  [0805]
C213  100n  [0805]
C217  100n  [0805]
C218  100n  [0805]
R154  RX  [0805]
R156  RX  [0805]
R158  RX  [0805]
R159  RX  [0805]
R162  RX  [0805]
R163  RX  [0805]
R165  2RX  [0805]
R167  2RX  [0805]
R169  RX  [0805]
R170  RX  [0805]
R172  RX  [0805]
R176  RX  [0805]
R180  RX  [0805]
R181  RX  [0805]
R183  2RX  [0805]
R186  2RX  [0805]
R189  RX  [0805]
R191  RX  [0805]
R194  RX  [0805]
R195  RX  [0805]
R198  RX  [0805]
R199  RX  [0805]
R203  2RX  [0805]
R205  2RX  [0805]
U27  OPA16X4  [SOIC127P600X175-14M]  (value not drawn)  (parts A,B,C,D,E of 5)
U28  OPA16X4  [SOIC127P600X175-14M]  (value not drawn)  (parts A,B,C,D,E of 5)
U29  OPA16X4  [SOIC127P600X175-14M]  (value not drawn)  (parts A,B,C,D,E of 5)

### Ports
HI (out), HIMID (out), IN (in), LO (out), LOMID (out)

### Nets
17V5: C211.1 C213.1 C218.1 U27.4(V+) U28.4(V+) U29.4(V+)
-17V5: C204.1 C206.1 C217.1 U27.11(V-) U28.11(V-) U29.11(V-)
GND: C152.1 C154.1 C174.1 C176.1 C198.1 C200.1 C204.2 C206.2 C211.2 C213.2 C217.2 C218.2 R165.2 R167.1 R183.2 R186.1 R203.2 R205.1
HI: R163.1 U27.6(IN_B-) U27.7(OUT_B) ; port HI
HIMID: R181.1 U28.6(IN_B-) U28.7(OUT_B) ; port HIMID
IN: C142.1 R154.1 ; port IN
LO: C182.1 C188.1 U29.8(OUT_C) U29.9(IN_C-) ; port LO
LOMID: R199.1 U29.6(IN_B-) U29.7(OUT_B) ; port LOMID
NetC136_1: C136.1 C143.1 R158.1 U27.13(IN_D-) U27.14(OUT_D)
NetC136_2: C136.2 C143.2 R154.2 R156.1
NetC139_1: C139.1 C145.1 C162.1 R169.1 U27.8(OUT_C) U27.9(IN_C-)
NetC139_2: C139.2 C145.2 R158.2 R159.1
NetC142_2: C142.2 C148.1 R162.2
NetC148_2: C148.2 R167.2 U27.3(+IN_A)
NetC149_1: C149.1 R162.1 U27.1(OUT_A) U27.2(-IN_A)
NetC149_2: C149.2 C150.1 R163.2
NetC150_2: C150.2 R165.1 U27.5(IN_B+)
NetC152_2: C152.2 R156.2 U27.12(IN_D+)
NetC154_2: C154.2 R159.2 U27.10(IN_C+)
NetC155_1: C155.1 C163.1 R170.1 U28.13(IN_D-) U28.14(OUT_D)
NetC155_2: C155.2 C163.2 R169.2 R172.1
NetC158_1: C158.1 C166.1 C185.2 R189.1 U28.8(OUT_C) U28.9(IN_C-)
NetC158_2: C158.2 C166.2 R170.2 R176.1
NetC162_2: C162.2 C170.1 R180.2
NetC170_2: C170.2 R186.2 U28.3(+IN_A)
NetC171_1: C171.1 R180.1 U28.1(OUT_A) U28.2(-IN_A)
NetC171_2: C171.2 C172.1 R181.2
NetC172_2: C172.2 R183.1 U28.5(IN_B+)
NetC174_2: C174.2 R172.2 U28.12(IN_D+)
NetC176_2: C176.2 R176.2 U28.10(IN_C+)
NetC180_1: C180.1 C186.1 R194.1 U29.13(IN_D-) U29.14(OUT_D)
NetC180_2: C180.2 C186.2 R189.2 R191.1
NetC182_2: C182.2 C188.2 R194.2 R195.1
NetC185_1: C185.1 C192.1 R198.2
NetC192_2: C192.2 R205.2 U29.3(+IN_A)
NetC193_1: C193.1 R198.1 U29.1(OUT_A) U29.2(-IN_A)
NetC193_2: C193.2 C194.1 R199.2
NetC194_2: C194.2 R203.1 U29.5(IN_B+)
NetC198_2: C198.2 R191.2 U29.12(IN_D+)
NetC200_2: C200.2 R195.2 U29.10(IN_C+)

### Channels
ch1/rxo: designators end in _$ChannelName#1; ports HI=NetR56_$ChannelName#1_2 HIMID=NetR61_$ChannelName#1_2 IN=NetC79_$ChannelName#1_2 LO=NetC182_$ChannelName#1_1 LOMID=NetR64_$ChannelName#1_2
ch1/lxo: designators end in _$ChannelName#2; ports HI=NetR16_$ChannelName#1_2 HIMID=NetR18_$ChannelName#1_2 IN=NetC65_$ChannelName#1_2 LO=NetC182_$ChannelName#2_1 LOMID=NetR25_$ChannelName#1_2
ch2/rxo: designators end in _$ChannelName#3; ports HI=NetR56_$ChannelName#2_2 HIMID=NetR61_$ChannelName#2_2 IN=NetC79_$ChannelName#2_2 LO=NetC182_$ChannelName#3_1 LOMID=NetR64_$ChannelName#2_2
ch2/lxo: designators end in _$ChannelName#4; ports HI=NetR16_$ChannelName#2_2 HIMID=NetR18_$ChannelName#2_2 IN=NetC65_$ChannelName#2_2 LO=NetC182_$ChannelName#4_1 LOMID=NetR25_$ChannelName#2_2
ch3/rxo: designators end in _$ChannelName#5; ports HI=NetR56_$ChannelName#3_2 HIMID=NetR61_$ChannelName#3_2 IN=NetC79_$ChannelName#3_2 LO=NetC182_$ChannelName#5_1 LOMID=NetR64_$ChannelName#3_2
ch3/lxo: designators end in _$ChannelName#6; ports HI=NetR16_$ChannelName#3_2 HIMID=NetR18_$ChannelName#3_2 IN=NetC65_$ChannelName#3_2 LO=NetC182_$ChannelName#6_1 LOMID=NetR25_$ChannelName#3_2
ch4/rxo: designators end in _$ChannelName#7; ports HI=NetR56_$ChannelName#4_2 HIMID=NetR61_$ChannelName#4_2 IN=NetC79_$ChannelName#4_2 LO=NetC182_$ChannelName#7_1 LOMID=NetR64_$ChannelName#4_2
ch4/lxo: designators end in _$ChannelName#8; ports HI=NetR16_$ChannelName#4_2 HIMID=NetR18_$ChannelName#4_2 IN=NetC65_$ChannelName#4_2 LO=NetC182_$ChannelName#8_1 LOMID=NetR25_$ChannelName#4_2

### Library data of the parts
C136 C139 C142 C143 C145 C148-C150 C152 C154 = CAP: PartNumber: NMC0805NPO562J50TRPLPF; Supplier 1: Arrow; Supplier Part Number 1: NMC0805NPO562J50TRPLPF
C155 C158 C162 C163 C166 C170-C172 C174 C176 = CAP: PartNumber: C0805C223J5JACTU; Supplier 1: Arrow; Supplier Part Number 1: C0805C223J5JACTU
C180 C182 C185 C186 C188 C192-C194 C198 C200 = CAP: PartNumber: NMC0805X7R823J50TRPF; Supplier 1: Arrow; Supplier Part Number 1: NMC0805X7R823J50TRPF
C204 C206 C211 C213 C217 C218 = CAP: PartNumber: C0805C104K1RAC7800; Supplier 1: Arrow; Supplier Part Number 1: C0805C104K1RAC7800
R154 R156 R158 R159 R162 R163 R169 R170 R172 R176 R180 R181 R189 R191 R194 R195 R198 R199 = RES: PartNumber: ERJ-6ENF4871V; Supplier 1: Arrow; Supplier Part Number 1: ERJ-6ENF4871V
  R191: Parameter 1: *
R165 R167 R183 R186 R203 R205 = RES: PartNumber: ERJ-6ENF9761V; Supplier 1: Arrow; Supplier Part Number 1: ERJ-6ENF9761V
U27-U29 = OPA16X4: PartNumber: OPA1664AIDR; Supplier 1: Arrow; Supplier Part Number 1: OPA1664AIDR

## Nets that join several sheets
17V5: mix (23 pins), ch1 (12 pins), ch1/rxo (6 pins), ch1/lxo (6 pins), ch2 (12 pins), ch2/rxo (6 pins), ch2/lxo (6 pins), ch3 (12 pins), ch3/rxo (6 pins), ch3/lxo (6 pins), ch4 (12 pins), ch4/rxo (6 pins), ch4/lxo (6 pins)
-17V5: mix (22 pins), ch1 (12 pins), ch1/rxo (6 pins), ch1/lxo (6 pins), ch2 (12 pins), ch2/rxo (6 pins), ch2/lxo (6 pins), ch3 (12 pins), ch3/rxo (6 pins), ch3/lxo (6 pins), ch4 (12 pins), ch4/rxo (6 pins), ch4/lxo (6 pins)
GND: mix (79 pins), ch1 (49 pins), ch1/rxo (18 pins), ch1/lxo (18 pins), ch2 (49 pins), ch2/rxo (18 pins), ch2/lxo (18 pins), ch3 (49 pins), ch3/rxo (18 pins), ch3/lxo (18 pins), ch4 (49 pins), ch4/rxo (18 pins), ch4/lxo (18 pins)
NetC41_1: mix (C41.1 R77.1 U6.9), ch1 (R15_$ChannelName#1.2)
NetC41_2: mix (C41.2 R51.1 R77.2 U6.8), ch1 (R1_$ChannelName#1.1)
NetC45_1: mix (C45.1 R81.1 U6.6), ch1 (R36_$ChannelName#1.2)
NetC45_2: mix (C45.2 R80.1 R81.2 U6.7), ch1 (R1_$ChannelName#1.4)
NetC50_1: mix (C50.1 R83.1 U6.13), ch2 (R15_$ChannelName#2.2)
NetC50_2: mix (C50.2 R82.1 R83.2 U6.14), ch2 (R1_$ChannelName#2.1)
NetC56_1: mix (C56.1 R89.1 U6.2), ch2 (R36_$ChannelName#2.2)
NetC56_2: mix (C56.2 R88.1 R89.2 U6.1), ch2 (R1_$ChannelName#2.4)
NetC59_1: mix (C59.1 R94.1 U7.9), ch3 (R15_$ChannelName#3.2)
NetC59_2: mix (C59.2 R92.1 R94.2 U7.8), ch3 (R1_$ChannelName#3.1)
NetC60_1: mix (C60.1 R96.1 U7.6), ch3 (R36_$ChannelName#3.2)
NetC60_2: mix (C60.2 R95.1 R96.2 U7.7), ch3 (R1_$ChannelName#3.4)
NetC61_1: mix (C61.1 R98.1 U7.13), ch4 (R15_$ChannelName#4.2)
NetC61_2: mix (C61.2 R97.1 R98.2 U7.14), ch4 (R1_$ChannelName#4.1)
NetC62_1: mix (C62.1 R100.1 U7.2), ch4 (R36_$ChannelName#4.2)
NetC62_2: mix (C62.2 R99.1 R100.2 U7.1), ch4 (R1_$ChannelName#4.4)
NetC63_1: mix (C63.1 R106.1 U10.13), ch1 (R75_$ChannelName#1.2), ch2 (R75_$ChannelName#2.2), ch3 (R75_$ChannelName#3.2), ch4 (R75_$ChannelName#4.2)
NetC64_1: mix (C64.1 R107.1 U10.9), ch1 (R76_$ChannelName#1.2), ch2 (R76_$ChannelName#2.2), ch3 (R76_$ChannelName#3.2), ch4 (R76_$ChannelName#4.2)
NetC65_$ChannelName#1_2: ch1 (C65_$ChannelName#1.2 R54_$ChannelName#1.1), ch1/lxo (C142_$ChannelName#2.1 R154_$ChannelName#2.1)
NetC65_$ChannelName#2_2: ch2 (C65_$ChannelName#2.2 R54_$ChannelName#2.1), ch2/lxo (C142_$ChannelName#4.1 R154_$ChannelName#4.1)
NetC65_$ChannelName#3_2: ch3 (C65_$ChannelName#3.2 R54_$ChannelName#3.1), ch3/lxo (C142_$ChannelName#6.1 R154_$ChannelName#6.1)
NetC65_$ChannelName#4_2: ch4 (C65_$ChannelName#4.2 R54_$ChannelName#4.1), ch4/lxo (C142_$ChannelName#8.1 R154_$ChannelName#8.1)
NetC79_$ChannelName#1_2: ch1 (C79_$ChannelName#1.2 R73_$ChannelName#1.2), ch1/rxo (C142_$ChannelName#1.1 R154_$ChannelName#1.1)
NetC79_$ChannelName#2_2: ch2 (C79_$ChannelName#2.2 R73_$ChannelName#2.2), ch2/rxo (C142_$ChannelName#3.1 R154_$ChannelName#3.1)
NetC79_$ChannelName#3_2: ch3 (C79_$ChannelName#3.2 R73_$ChannelName#3.2), ch3/rxo (C142_$ChannelName#5.1 R154_$ChannelName#5.1)
NetC79_$ChannelName#4_2: ch4 (C79_$ChannelName#4.2 R73_$ChannelName#4.2), ch4/rxo (C142_$ChannelName#7.1 R154_$ChannelName#7.1)
NetC182_$ChannelName#1_1: ch1 (R65_$ChannelName#1.2 R151_$ChannelName#1.6), ch1/rxo (C182_$ChannelName#1.1 C188_$ChannelName#1.1 U29_$ChannelName#1.8 U29_$ChannelName#1.9)
NetC182_$ChannelName#2_1: ch1 (R52_$ChannelName#1.2 R151_$ChannelName#1.3), ch1/lxo (C182_$ChannelName#2.1 C188_$ChannelName#2.1 U29_$ChannelName#2.8 U29_$ChannelName#2.9)
NetC182_$ChannelName#3_1: ch2 (R65_$ChannelName#2.2 R151_$ChannelName#2.6), ch2/rxo (C182_$ChannelName#3.1 C188_$ChannelName#3.1 U29_$ChannelName#3.8 U29_$ChannelName#3.9)
NetC182_$ChannelName#4_1: ch2 (R52_$ChannelName#2.2 R151_$ChannelName#2.3), ch2/lxo (C182_$ChannelName#4.1 C188_$ChannelName#4.1 U29_$ChannelName#4.8 U29_$ChannelName#4.9)
NetC182_$ChannelName#5_1: ch3 (R65_$ChannelName#3.2 R151_$ChannelName#3.6), ch3/rxo (C182_$ChannelName#5.1 C188_$ChannelName#5.1 U29_$ChannelName#5.8 U29_$ChannelName#5.9)
NetC182_$ChannelName#6_1: ch3 (R52_$ChannelName#3.2 R151_$ChannelName#3.3), ch3/lxo (C182_$ChannelName#6.1 C188_$ChannelName#6.1 U29_$ChannelName#6.8 U29_$ChannelName#6.9)
NetC182_$ChannelName#7_1: ch4 (R65_$ChannelName#4.2 R151_$ChannelName#4.6), ch4/rxo (C182_$ChannelName#7.1 C188_$ChannelName#7.1 U29_$ChannelName#7.8 U29_$ChannelName#7.9)
NetC182_$ChannelName#8_1: ch4 (R52_$ChannelName#4.2 R151_$ChannelName#4.3), ch4/lxo (C182_$ChannelName#8.1 C188_$ChannelName#8.1 U29_$ChannelName#8.8 U29_$ChannelName#8.9)
NetR16_$ChannelName#1_2: ch1 (R16_$ChannelName#1.2 R148_$ChannelName#1.3), ch1/lxo (R163_$ChannelName#2.1 U27_$ChannelName#2.6 U27_$ChannelName#2.7)
NetR16_$ChannelName#2_2: ch2 (R16_$ChannelName#2.2 R148_$ChannelName#2.3), ch2/lxo (R163_$ChannelName#4.1 U27_$ChannelName#4.6 U27_$ChannelName#4.7)
NetR16_$ChannelName#3_2: ch3 (R16_$ChannelName#3.2 R148_$ChannelName#3.3), ch3/lxo (R163_$ChannelName#6.1 U27_$ChannelName#6.6 U27_$ChannelName#6.7)
NetR16_$ChannelName#4_2: ch4 (R16_$ChannelName#4.2 R148_$ChannelName#4.3), ch4/lxo (R163_$ChannelName#8.1 U27_$ChannelName#8.6 U27_$ChannelName#8.7)
NetR18_$ChannelName#1_2: ch1 (R18_$ChannelName#1.2 R149_$ChannelName#1.3), ch1/lxo (R181_$ChannelName#2.1 U28_$ChannelName#2.6 U28_$ChannelName#2.7)
NetR18_$ChannelName#2_2: ch2 (R18_$ChannelName#2.2 R149_$ChannelName#2.3), ch2/lxo (R181_$ChannelName#4.1 U28_$ChannelName#4.6 U28_$ChannelName#4.7)
NetR18_$ChannelName#3_2: ch3 (R18_$ChannelName#3.2 R149_$ChannelName#3.3), ch3/lxo (R181_$ChannelName#6.1 U28_$ChannelName#6.6 U28_$ChannelName#6.7)
NetR18_$ChannelName#4_2: ch4 (R18_$ChannelName#4.2 R149_$ChannelName#4.3), ch4/lxo (R181_$ChannelName#8.1 U28_$ChannelName#8.6 U28_$ChannelName#8.7)
NetR25_$ChannelName#1_2: ch1 (R25_$ChannelName#1.2 R150_$ChannelName#1.3), ch1/lxo (R199_$ChannelName#2.1 U29_$ChannelName#2.6 U29_$ChannelName#2.7)
NetR25_$ChannelName#2_2: ch2 (R25_$ChannelName#2.2 R150_$ChannelName#2.3), ch2/lxo (R199_$ChannelName#4.1 U29_$ChannelName#4.6 U29_$ChannelName#4.7)
NetR25_$ChannelName#3_2: ch3 (R25_$ChannelName#3.2 R150_$ChannelName#3.3), ch3/lxo (R199_$ChannelName#6.1 U29_$ChannelName#6.6 U29_$ChannelName#6.7)
NetR25_$ChannelName#4_2: ch4 (R25_$ChannelName#4.2 R150_$ChannelName#4.3), ch4/lxo (R199_$ChannelName#8.1 U29_$ChannelName#8.6 U29_$ChannelName#8.7)
NetR56_$ChannelName#1_2: ch1 (R56_$ChannelName#1.2 R148_$ChannelName#1.6), ch1/rxo (R163_$ChannelName#1.1 U27_$ChannelName#1.6 U27_$ChannelName#1.7)
NetR56_$ChannelName#2_2: ch2 (R56_$ChannelName#2.2 R148_$ChannelName#2.6), ch2/rxo (R163_$ChannelName#3.1 U27_$ChannelName#3.6 U27_$ChannelName#3.7)
NetR56_$ChannelName#3_2: ch3 (R56_$ChannelName#3.2 R148_$ChannelName#3.6), ch3/rxo (R163_$ChannelName#5.1 U27_$ChannelName#5.6 U27_$ChannelName#5.7)
NetR56_$ChannelName#4_2: ch4 (R56_$ChannelName#4.2 R148_$ChannelName#4.6), ch4/rxo (R163_$ChannelName#7.1 U27_$ChannelName#7.6 U27_$ChannelName#7.7)
NetR61_$ChannelName#1_2: ch1 (R61_$ChannelName#1.2 R149_$ChannelName#1.6), ch1/rxo (R181_$ChannelName#1.1 U28_$ChannelName#1.6 U28_$ChannelName#1.7)
NetR61_$ChannelName#2_2: ch2 (R61_$ChannelName#2.2 R149_$ChannelName#2.6), ch2/rxo (R181_$ChannelName#3.1 U28_$ChannelName#3.6 U28_$ChannelName#3.7)
NetR61_$ChannelName#3_2: ch3 (R61_$ChannelName#3.2 R149_$ChannelName#3.6), ch3/rxo (R181_$ChannelName#5.1 U28_$ChannelName#5.6 U28_$ChannelName#5.7)
NetR61_$ChannelName#4_2: ch4 (R61_$ChannelName#4.2 R149_$ChannelName#4.6), ch4/rxo (R181_$ChannelName#7.1 U28_$ChannelName#7.6 U28_$ChannelName#7.7)
NetR64_$ChannelName#1_2: ch1 (R64_$ChannelName#1.2 R150_$ChannelName#1.6), ch1/rxo (R199_$ChannelName#1.1 U29_$ChannelName#1.6 U29_$ChannelName#1.7)
NetR64_$ChannelName#2_2: ch2 (R64_$ChannelName#2.2 R150_$ChannelName#2.6), ch2/rxo (R199_$ChannelName#3.1 U29_$ChannelName#3.6 U29_$ChannelName#3.7)
NetR64_$ChannelName#3_2: ch3 (R64_$ChannelName#3.2 R150_$ChannelName#3.6), ch3/rxo (R199_$ChannelName#5.1 U29_$ChannelName#5.6 U29_$ChannelName#5.7)
NetR64_$ChannelName#4_2: ch4 (R64_$ChannelName#4.2 R150_$ChannelName#4.6), ch4/rxo (R199_$ChannelName#7.1 U29_$ChannelName#7.6 U29_$ChannelName#7.7)